# EAGLE design 606_joystick (EAGLE 9.6.2)
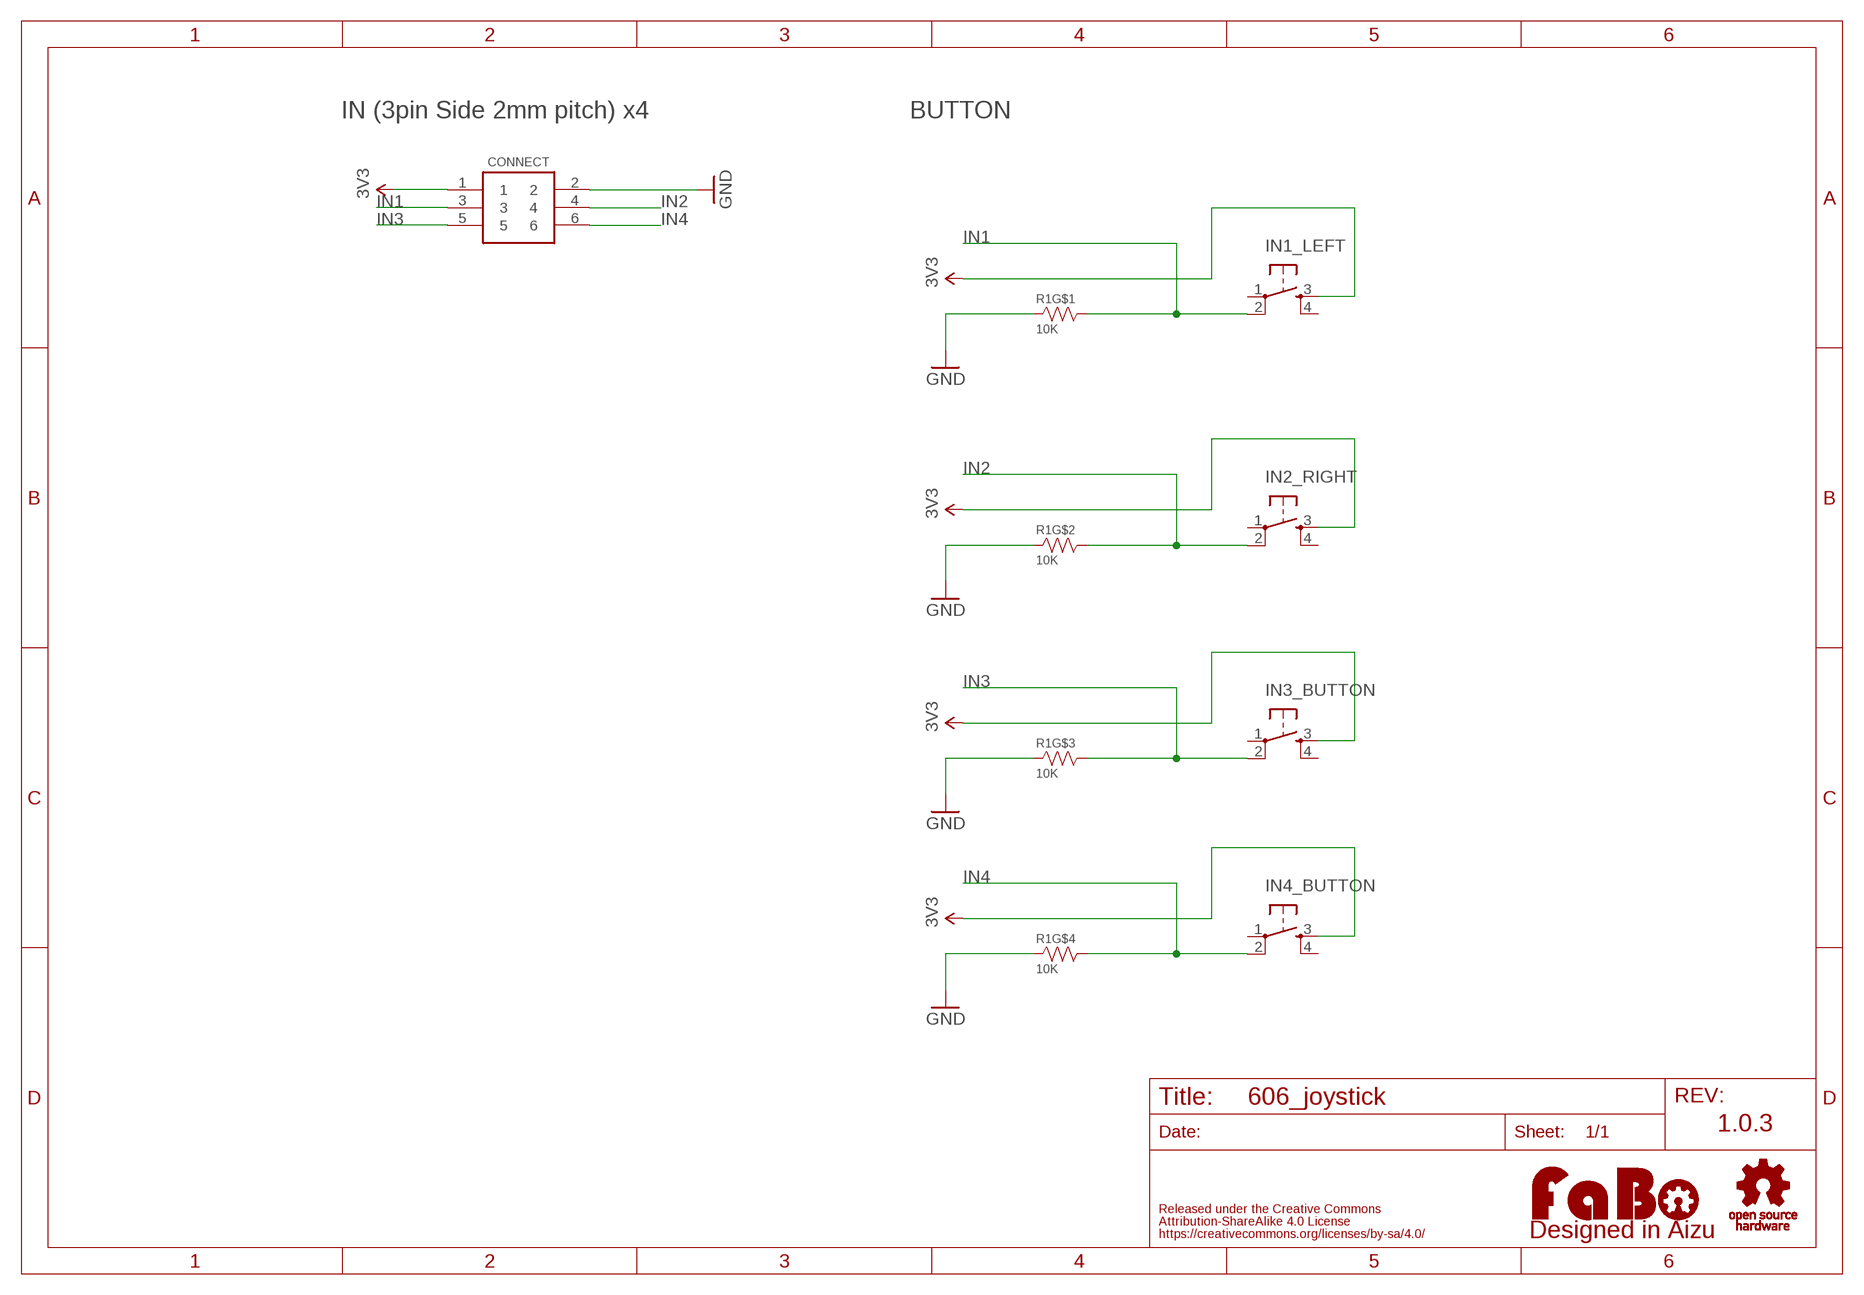
[diagram p0: schematic, sheet 1]

## Parts
CONNECT  IDC_CONNECTOR_BOTTOM  [2X3_IDC_BOTTOM]
IN1_LEFT  TACT-SWITCH-12MM  [1273HA-160G-G]
IN2_RIGHT  TACT-SWITCH-12MM  [1273HA-160G-G]
IN3_BUTTON  TACT-SWITCH-12MM  [1273HA-160G-G]
IN4_BUTTON  TACT-SWITCH-12MM  [1273HA-160G-G]
LOGO1  LOGO_FABO-M  [LOGO_FABO_M]
R1  10K  RESISTOR_ARRAY  [EXBV8V]
U$2  LOGO_OSHW-M_BOTTOM  [LOGO_OSHW_M_BOTTOM]

## Nets
3V3: CONNECT.1 IN1_LEFT.3 IN2_RIGHT.3 IN3_BUTTON.3 IN4_BUTTON.3
GND: CONNECT.2 R1.1 R1.2 R1.3 R1.4
IN1: CONNECT.3 IN1_LEFT.2 R1.8
IN2: CONNECT.4 IN2_RIGHT.2 R1.7
IN3: CONNECT.5 IN3_BUTTON.2 R1.6
IN4: CONNECT.6 IN4_BUTTON.2 R1.5
Unconnected: IN1_LEFT.1 IN1_LEFT.4 IN2_RIGHT.1 IN2_RIGHT.4 IN3_BUTTON.1 IN3_BUTTON.4 IN4_BUTTON.1 IN4_BUTTON.4

## Notes on the sheet
- IN (3pin Side 2mm pitch) x4 | BUTTON
- 1.0.3

## Library data of the parts
CONNECT = FaBo-Connetor:IDC_CONNECTOR
IN1_LEFT IN2_RIGHT IN3_BUTTON IN4_BUTTON = FaBo-Switch:TACT-SWITCH: Part No Maker Datasheet Distributor 1273HA-160G-G SWITRONIC Catalog <http://www.switronic.com/uploads/images/A10.gif> Akizuki <http://akizukidenshi.com/catalog/g/gP-02561/> DTS-6-V Cosland DTS 6 Series <http://www.cosland.com/newproduct/DTS%20SERIES.pdf> Akizuki <http://akizukidenshi.com/catalog/g/gP-03647/> KMR2 C&K KMR2 SERIES <https://www.ckswitches.com/products/switches/product-details/Tactile/KMR2/> Octoparts Result <https://octopart.com/search?q=KMR2&start=0> TSHA-T-XB2-19E TOP UP INDUSTORY TSHA-T <http://www.top-up.com.tw/front/bin/ptdetail.phtml?Part=TSHA-T> Akizuki <http://akizukidenshi.com/catalog/g/gP-09361/>
LOGO1 = component:LOGO_FABO
R1 = component:RESISTOR_ARRAY
U$2 = component:LOGO_OSHW

## Board
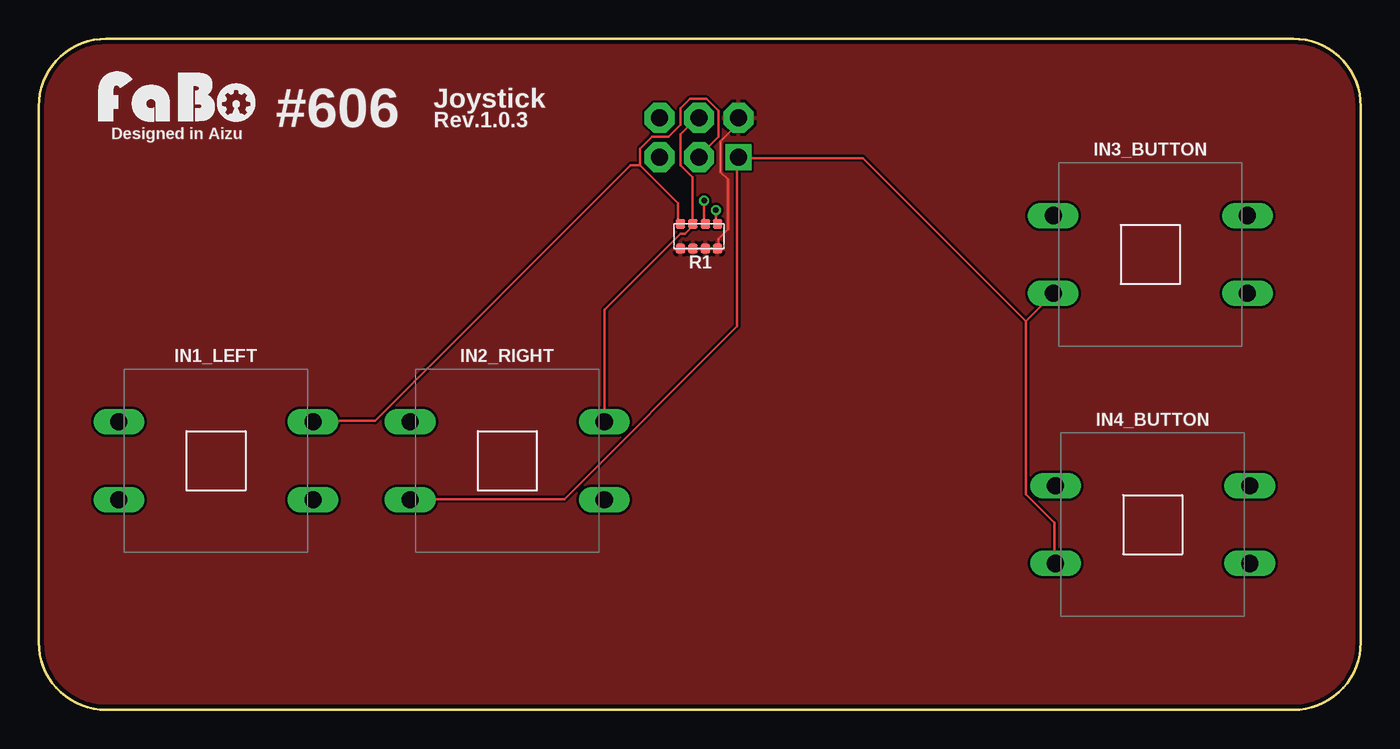
[diagram p1: board, top side]
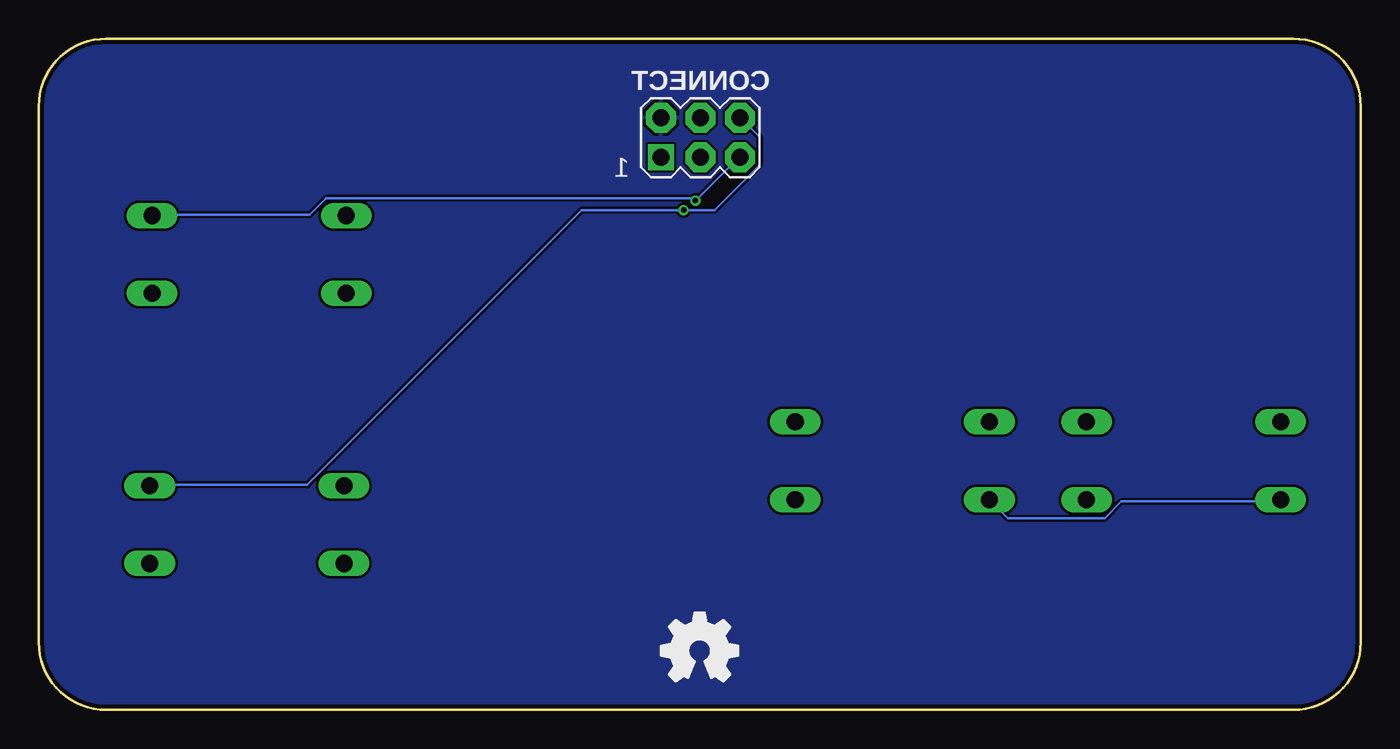
[diagram p2: board, bottom side, seen from below]

Size 85.09 x 43.18 mm. Coordinates in mm from the lower left corner, seen from the top.
Outline: 0,38.84 0,4.34 arc90 4.34,0 80.75,0 arc90 85.09,4.34 85.09,38.84 arc90 80.75,43.18 4.34,43.18 arc90 0,38.84
Copper layers (1*16): Top 0.035mm / dielectric 1.6mm / Bottom 0.035mm
Design rules "PCBway": minimum track width 6mil, minimum drill 12mil, track to track 6mil, track to pad 6mil, pad to pad 6mil, via to via 6mil, smd to smd 6mil, copper to edge 10mil, drill to drill 10mil, minimum pad ring 10mil, minimum via ring 6mil, stop-mask expansion 2mil, vias tented up to drill 100mil, thermal gap 8mil

### Footprints (pad centres in the part's own frame; a part is rotated, then mirrored left to right if it is on the bottom)
2X3_IDC_BOTTOM = drill 1.1 pad 1.676 square: 1 2.54,-1.27 | drill 1.1 pad 1.93 octagon: 2 2.54,1.27; 3 0,-1.27; 4 0,1.27; 5 -2.54,-1.27; 6 -2.54,1.27
1273HA-160G-G = drill 1.1 long: 1 -6.25,2.5; 2 6.25,2.5; 3 -6.25,-2.5; 4 6.25,-2.5
EXBV8V = smd 0.6 x 0.6: 1 -1.2,-0.8; 2 -0.4,-0.8; 3 0.4,-0.8; 4 1.2,-0.8; 5 1.2,0.8; 6 0.4,0.8; 7 -0.4,0.8; 8 -1.2,0.8

### Placement (x,y rotation side)
CONNECT  42.5,36.83 0 top
IN1_LEFT  11.4,16.03 0 top
IN2_RIGHT  30.15,16.03 0 top
IN3_BUTTON  71.55,29.31 0 top
IN4_BUTTON  71.7,11.92 0 top
LOGO1  8.89,37.47 0 top
R1  42.5,30.48 0 top
U$2  42.55,3.81 0 top

### Tracks (layer width: path | path; a pad name or v marks a point on that pad's centre or on a via)
3V3
  Top 0.152: 63.55,24.99 63.55,13.87 65.38,12.04 65.38,9.45 IN4_BUTTON.3 | 63.55,24.99 65.23,26.67 IN3_BUTTON.3 | 63.55,24.99 53.03,35.51 45.11,35.51 CONNECT.1 44.96,35.51 44.96,24.69 33.83,13.56 23.93,13.56 IN2_RIGHT.3
  Bottom 0.152: IN1_LEFT.3 5.18,13.41 15.39,13.41 16.46,12.34 22.71,12.34 23.77,13.41 IN2_RIGHT.3
GND
  Top 0.152: R1.1 41.3,29.72 42.06,29.72 R1.2 42.22,29.72 42.82,29.72 R1.3 42.98,29.72 43.59,29.72 R1.4 43.74,29.72 43.74,30.33 44.35,30.94 44.35,34.14 43.89,34.59 43.89,36.58 44.96,37.64 44.96,38.1 CONNECT.2
  pour Bottom: 0,0 0,43.18 85.09,43.18 85.09,0
  pour Top: 0,0 0,43.18 85.09,43.18 85.09,0
IN1
  Top 0.152: 38.71,35.05 41.15,32.61 41.15,31.39 R1.8 | 38.71,35.05 38.71,36.12 39.47,36.88 40.54,36.88 41.3,37.64 41.3,38.71 41.91,39.32 42.98,39.32 43.74,38.56 43.74,36.88 42.52,35.66 CONNECT.3 | 38.71,35.05 38.1,35.05 21.64,18.59 17.68,18.59 IN1_LEFT.2
IN2
  Top 0.152: CONNECT.4 42.37,38.1 41.3,37.03 41.3,35.05 42.06,34.29 42.06,31.39 R1.7 42.22,31.24 41.6,30.63 41.3,30.63 36.42,25.76 36.42,18.59 IN2_RIGHT.2
IN3  (via drill 0.35)
  Top 0.152: v42.82,32.77 42.82,31.39 R1.6
  Bottom 0.152: 42.67,32.92 40.08,35.51 CONNECT.5 | 42.67,32.92 66.6,32.92 67.67,31.85 77.72,31.85 IN3_BUTTON.2 | 42.67,32.92 v42.82,32.77
IN4  (via drill 0.35)
  Top 0.152: v43.59,32.16 43.59,31.39 R1.5
  Bottom 0.152: CONNECT.6 39.93,38.1 38.71,36.88 38.71,35.05 41.6,32.16 v43.59,32.16 50.14,32.16 67.82,14.48 77.88,14.48 IN4_BUTTON.2

### Text on the board
tPlace: Joystick | Designed in Aizu | #606 | Rev.1.0.3